# Altium schematic sheet 1_Power.SchDoc
size A3; DocumentNumber: 2; SheetNumber: 2; SheetTotal: 6
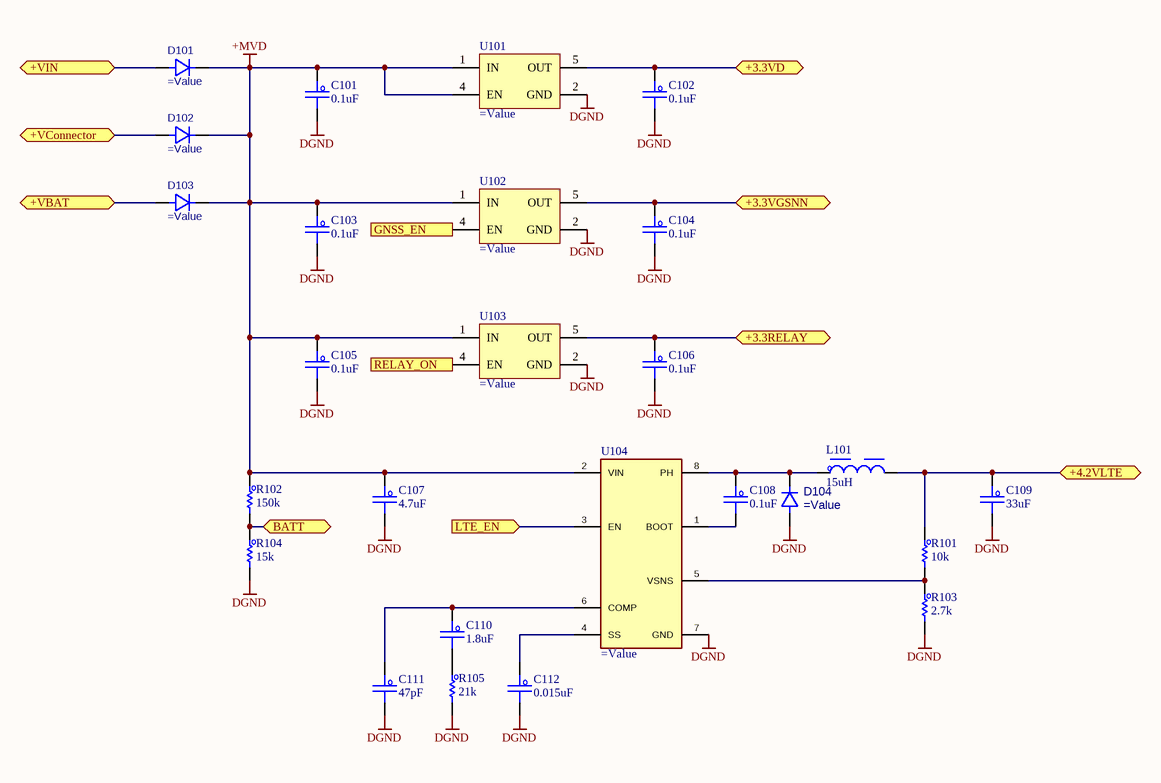
[diagram p0: 1_Power.SchDoc]

## Parts
C101  0.1uF  [C_0603]
C102  0.1uF  [C_0603]
C103  0.1uF  [C_0603]
C104  0.1uF  [C_0603]
C105  0.1uF  [C_0603]
C106  0.1uF  [C_0603]
C107  4.7uF  [C_1206]
C108  0.1uF  [C_0603]
C109  33uF  [C_0805]
C110  1.8uF  [C_0603]
C111  47pF  [C_0603]
C112  0.015uF  [C_0603]
D101  (no value)  [SOD323]
D102  (no value)  [SOD323]  (no BOM)
D103  (no value)  [SOD323]  (no BOM)
D104  (no value)  [DFN119P160X30-2M]
L101  15uH  [IND_04054150_WRE]
R101  10k  [R_0603]
R102  150k  [R_0603]
R103  2.7k  [R_0603]
R104  15k  [R_0603]
R105  21k  [R_0603]
U101  (no value)  [SOT95P280X145-5N]
U102  (no value)  [SOT95P280X145-5N]
U103  (no value)  [SOT95P280X145-5N]
U104  (no value)  [SO-8_STM]

## Ports
+3.3RELAY (bidir), +3.3VD (bidir), +3.3VGSNN (bidir), +4.2VLTE (bidir), +VBAT (bidir), +VConnector (bidir), +VIN (bidir), BATT (bidir), GNSS_EN (in), LTE_EN (in), RELAY_ON (in)

## Nets
+MVD: C101.1 C103.1 C105.1 C107.1 D101.1 D102.1 D103.1 R102.1 U101.1(IN) U101.4(EN) U102.1(IN) U103.1(IN) U104.2(VIN)
DGND: C101.2 C102.2 C103.2 C104.2 C105.2 C106.2 C107.2 C109.2 C111.2 C112.2 D104.2 R103.2 R104.2 R105.2 U101.2(GND) U102.2(GND) U103.2(GND) U104.7(GND)
+3.3RELAY: C106.1 U103.5(OUT) ; port +3.3RELAY
+3.3VD: C102.1 U101.5(OUT) ; port +3.3VD
+3.3VGSNN: C104.1 U102.5(OUT) ; port +3.3VGSNN
+4.2VLTE: C109.1 L101.2 R101.1 ; port +4.2VLTE
+VBAT: D103.2 ; port +VBAT
+VConnector: D102.2 ; port +VConnector
+VIN: D101.2 ; port +VIN
BATT: R102.2 R104.1 ; port BATT
GNSS_EN: U102.4(EN) ; port GNSS_EN
LTE_EN: U104.3(EN) ; port LTE_EN
RELAY_ON: U103.4(EN) ; port RELAY_ON
NetC108_1: C108.1 D104.1 L101.1 U104.8(PH)
NetC108_2: C108.2 U104.1(BOOT)
NetC110_1: C110.1 C111.1 U104.6(COMP)
NetC110_2: C110.2 R105.1
NetC112_1: C112.1 U104.4(SS)
NetR101_2: R101.2 R103.1 U104.5(VSNS)

## Notes on the sheet
- Title :
- Revision :
- ผู้จัดทำ:
- Size:
- A3
- Time:
- ผู้เขียน:
- บริษัท ยูนิเวอร์แซล ยูทีลิตี้ส์ จำกัด (มหาชน) เลขที่ 1 อาคาร อีสท์วอเตอร์ ชั้น 18 ซอยวิภาวดีรังสิต 5 แขวงจอมพล เขตจตุจักร กรุงเทพฯ 10900
  Tel : +662-272-1688
  Fax :+662-2721690-1
- -
- Sheet:
- of
- ผู้อำนวยการ
- ผู้ตรวจสอบ:
- Number:
- กรรมการผู้จัดการ:
- File:

## Library data of the parts
C101-C106 C108 = C_Capacitor: CAP CER 0.1UF 50V X7R 0603; Manufacturer: KEMET; PartNumber: C0603C104K5RACTU; PackageReference: 0603; PartID: 399-5089-1-ND; Value2: 50V; Value: 0.1uF; Value3: *
C107 = C_Capacitor: CAP CER 4.7UF 50V X7R 1206; Manufacturer: KEMET; PartNumber: C1206C475K5RAC7800; PackageReference: 1206; PartID: 399-C1206C475K5RAC7800CT-ND; Value2: 50V; Value: 4.7uF; Value3: *
C109 = C_Capacitor: CAP CER 33UF 10V X5R 0805; Manufacturer: TDK Corporation; PartNumber: C2012X5R1A336M125AC; PackageReference: 0805; PartID: 445-8238-1-ND; Value2: 10V; Value: 33uF; Value3: *
C110 = C_Capacitor: CAP CER 1800PF 50V X7R 0603; Manufacturer: KEMET; PartNumber: C0603C182K5RAC7867; Value2: 10V; PackageReference: 0603; PartID: 399-C0603C182K5RAC7867CT-ND; Value: 1.8uF; Value3: *
C111 = C_Capacitor: CAP CER 47PF 50V X7R 0603; Manufacturer: KEMET; PartNumber: C0603C470J5RAC7867; PackageReference: 0603; PartID: 399-C0603C470J5RAC7867CT-ND; Value2: 50V; Value: 47pF; Value3: *
C112 = C_Capacitor: CAP CER 15PF 50V C0G/NP0 0603; Manufacturer: KEMET; PartNumber: C0603C150J5GAC7867; Value2: 10V; PackageReference: 0603; PartID: 399-C0603C150J5GAC7867CT-ND; Value: 0.015uF; Value3: *
D101-D103 = D_PW_SD103AWS: DIODE SCHOTTKY 40V 2A 0603; Manufacturer: Slkor(SLKORMICRO Elec.); Value: SD103AWS; PackageReference: SOD-323; PartID: C513472; PartNumber: SD103AWS
D104 = D_PW_VSKY20301608: DIODE SCHOTTKY 30V 2A 0603; Manufacturer: Vishay General Semiconductor - Diodes Division; Value: VSKY20301608-G4-08; PackageReference: 0603; PartID: 112-VSKY20301608-G4-08CT-ND; PartNumber: VSKY20301608-G4-08
L101 = L_74404054150: FIXED IND 15UH 2A 86 MOHM SMD; Manufacturer: Würth Elektronik; Value: 15uH; PackageReference: 0603; PartID: 732-5521-1-ND; PartNumber: 74404054150; Value3: *
R101 = R_Resister: RES 10K OHM 5% 1/10W 0603; Manufacturer: Vishay Dale; PartNumber: CRCW060310K0JNEBC; Value2: 0.1W; Value: 10k; PackageReference: 0603; PartID: 541-CRCW060310K0JNEBCCT-ND; Value3: *
R102 = R_Resister: RES SMD 150K OHM 1% 1/10W 0603; Manufacturer: Vishay Dale; PartNumber: CRCW0603150KFKEAC; Value2: 0.1W; Value: 150k; PackageReference: 0603; PartID: 541-4034-1-ND; Value3: *
R103 = R_Resister: RES 2.7K OHM 5% 1/10W 0603; Manufacturer: Vishay Dale; PartNumber: CRCW06032K70JNEAC; Value2: 0.1W; Value: 2.7k; PackageReference: 0603; PartID: 541-CRCW06032K70JNEACCT-ND; Value3: *
R104 = R_Resister: RES 15K OHM 5% 1/10W 0603; Manufacturer: Vishay Dale; PartNumber: CRCW060315K0JNEAC; Value2: 0.1W; Value: 15k; PackageReference: 0603; PartID: 541-CRCW060315K0JNEACCT-ND; Value3: *
R105 = R_Resister: RES SMD 150K OHM 1% 1/10W 0603; Value2: 0.1W; Value: 21k; PackageReference: 0603; Value3: *
U101-U103 = IC_LDO_RT9069-33GB: 200mA 360mV@(10mA) Fixed 3.3V~3.3V Positive 1 36V SOT-23-5 Linear Voltage Regulators (LDO) ROHS; Manufacturer: Richtek Tech; PartNumber: RT9069-33GB; PartID: C147969; PackageReference: SOT-23-5; Value: RT9069-33GB; Value2: *; Value3: *
U104 = IC_PMS_TPS54231DR: IC REG BUCK ADJUSTABLE 2A 8SOIC; Manufacturer: Texas Instruments; PartNumber: TPS54231DR; PartID: 595-TPS54231DR; PackageReference: 8-SOIC; Value: TPS54231DR; Value2: *; Value3: *